# Altium project V.PrjPcb
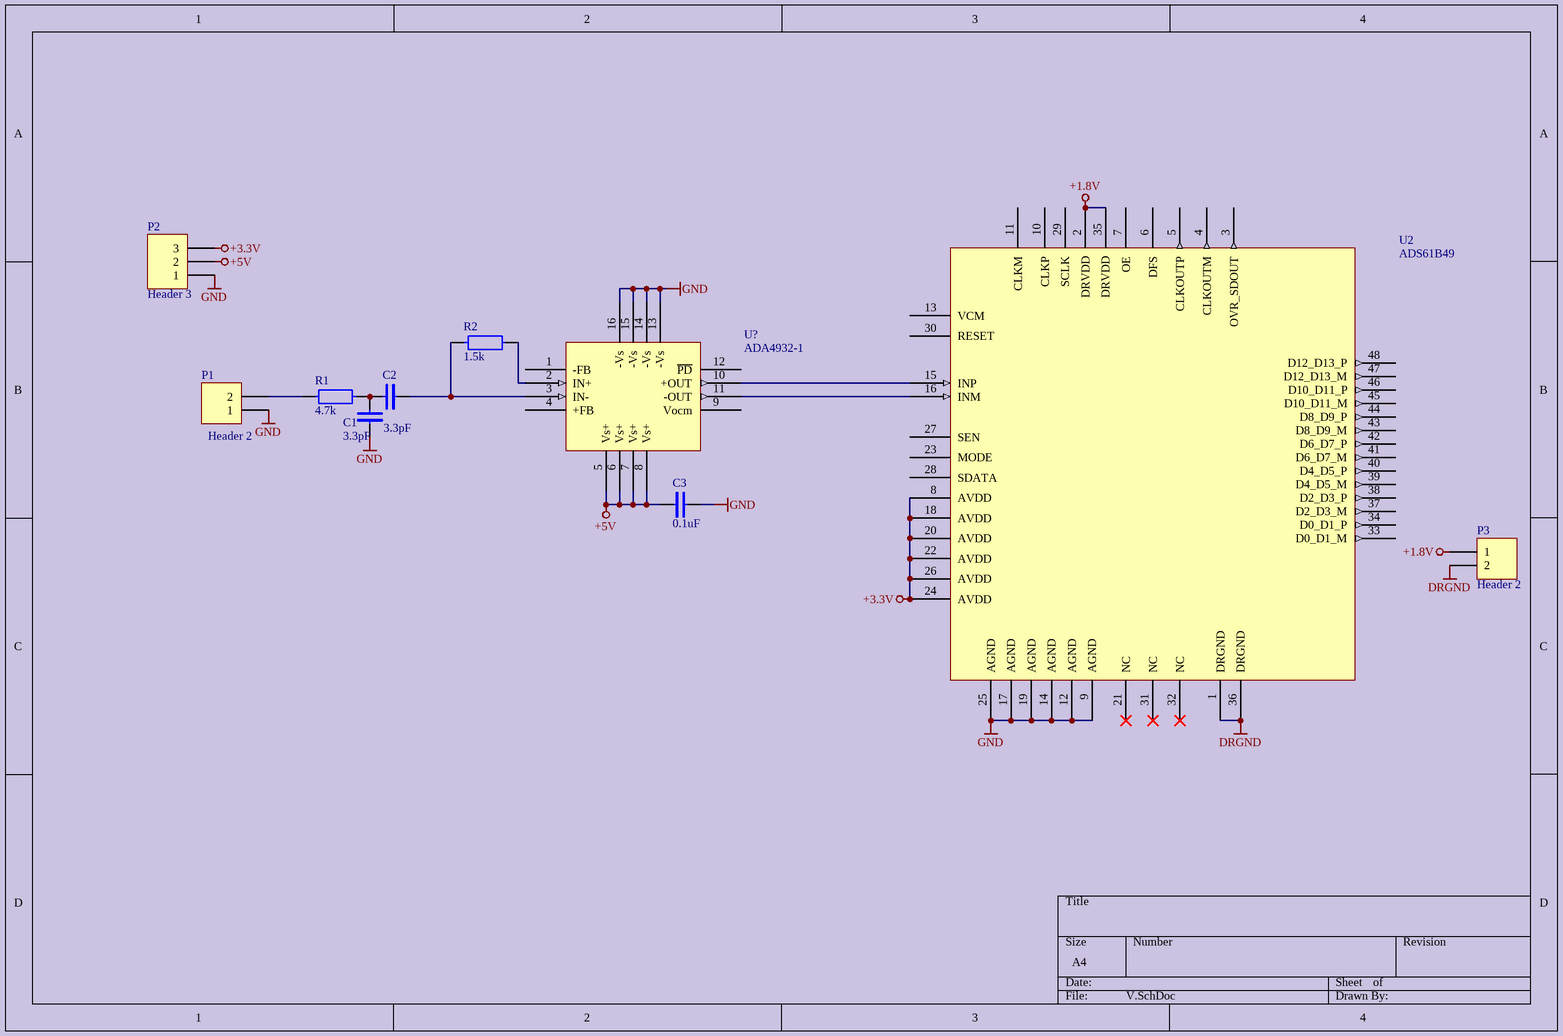
[diagram p0: V.SchDoc]
1 sheet, 10 parts. Net scope: global (net labels, ports and power ports of the same name join across sheets).
Board file: V.PcbDoc

## Sheet V.SchDoc
size A4

### Parts
C1  3.3pF  [0805]
C2  3.3pF  [0805]
C3  0.1uF  [0805]
P1  Header 2  [HDR1X2]
P2  Header 3  [HDR1X3]
P3  Header 2  [HDR1X2]
R1  4.7k  [0805]
R2  1.5k  [0805]
U2  ADS61B49  [QFN-48]
U?  ADA4932-1  [LFCSP-16]

### Nets
+1.8V: P3.1 U2.2(DRVDD) U2.35(DRVDD)
+3.3V: P2.3 U2.8(AVDD) U2.18(AVDD) U2.20(AVDD) U2.22(AVDD) U2.24(AVDD) U2.26(AVDD)
+5V: C3.1 P2.2 U?.5(Vs+) U?.6(Vs+) U?.7(Vs+) U?.8(Vs+)
DRGND: P3.2 U2.1(DRGND) U2.36(DRGND)
GND: C1.2 C3.2 P1.1 P2.1 U2.0(Therm_Pad) U2.9(AGND) U2.12(AGND) U2.14(AGND) U2.17(AGND) U2.19(AGND) U2.25(AGND) U?.13(-Vs) U?.14(-Vs) U?.15(-Vs) U?.16(-Vs) U?.17
NetC1_1: C1.1 C2.1 R1.2
NetC2_2: C2.2 R2.2 U?.3(IN-)
NetP1_2: P1.2 R1.1
NetR2_1: R2.1 U?.2(IN+)
NetU2_15: U2.15(INP) U?.10(+OUT)
NetU2_16: U2.16(INM) U?.11(-OUT)

Not connected (* = marked no-connect by the designer): U2 3(OVR_SDOUT) 4(CLKOUTM) 5(CLKOUTP) 6(DFS) 7(OE) 10(CLKP) 11(CLKM) 13(VCM) 21(NC)* 23(MODE) 27(SEN) 28(SDATA) 29(SCLK) 30(RESET) 31(NC)* 32(NC)* 33(D0_D1_M) 34(D0_D1_P) 37(D2_D3_M) 38(D2_D3_P) 39(D4_D5_M) 40(D4_D5_P) 41(D6_D7_M) 42(D6_D7_P) 43(D8_D9_M) 44(D8_D9_P) 45(D10_D11_M) 46(D10_D11_P) 47(D12_D13_M) 48(D12_D13_P); U? 1(-FB) 4(+FB) 9(Vocm) 12(~{PD})

### Library data of the parts
C1-C3 = Capacitor
P1 P3 = Header 2: Header, 2-Pin; LatestRevisionDate: 17-Jul-2002; LatestRevisionNote: Re-released for DXP Platform.; Publisher: Altium Limited
P2 = Header 3: Header, 3-Pin; LatestRevisionDate: 17-Jul-2002; LatestRevisionNote: Re-released for DXP Platform.; Publisher: Altium Limited
R1 R2 = Resistor